# Altium schematic sheet DriverPNP_Sch.SchDoc: DriverPNP
size 127 x 101 mm; Author: Hom; CompanyName: KitSprout; DrawnBy: Hom; Engineer: Hom; Organization: KitSprout; Revision: A; SheetNumber: 1; SheetTotal: 1; Version: 1.0; LibVersion: 1.1
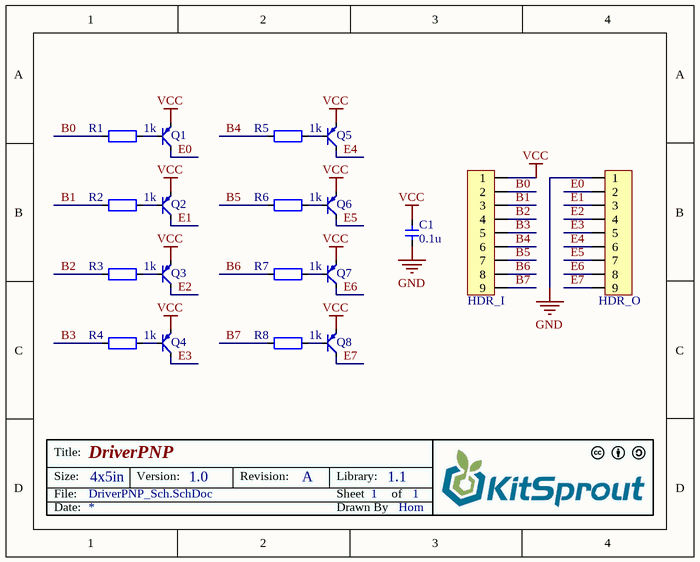
[diagram p0: DriverPNP_Sch.SchDoc]

## Parts
C1  value 0.1u  [CAP_0603]  (hidden comment: Cap_0603)
HDR_I  HDR1x9.54  [HDR1X9_2.54_180]  (value not drawn)
HDR_O  HDR1x9.54  [HDR1X9_2.54_180]  (value not drawn)
Q1  BJT_PNP  [SOT23-3]  (value not drawn)
Q2  BJT_PNP  [SOT23-3]  (value not drawn)
Q3  BJT_PNP  [SOT23-3]  (value not drawn)
Q4  BJT_PNP  [SOT23-3]  (value not drawn)
Q5  BJT_PNP  [SOT23-3]  (value not drawn)
Q6  BJT_PNP  [SOT23-3]  (value not drawn)
Q7  BJT_PNP  [SOT23-3]  (value not drawn)
Q8  BJT_PNP  [SOT23-3]  (value not drawn)
R1  value 1k  [RES_0603]  (hidden comment: Res_0603)
R2  value 1k  [RES_0603]  (hidden comment: Res_0603)
R3  value 1k  [RES_0603]  (hidden comment: Res_0603)
R4  value 1k  [RES_0603]  (hidden comment: Res_0603)
R5  value 1k  [RES_0603]  (hidden comment: Res_0603)
R6  value 1k  [RES_0603]  (hidden comment: Res_0603)
R7  value 1k  [RES_0603]  (hidden comment: Res_0603)
R8  value 1k  [RES_0603]  (hidden comment: Res_0603)

## Nets
GND: C1.1 HDR_O.1
VCC: C1.2 HDR_I.1 Q1.2(E) Q2.2(E) Q3.2(E) Q4.2(E) Q5.2(E) Q6.2(E) Q7.2(E) Q8.2(E)
B0: HDR_I.2 R1.1
B1: HDR_I.3 R2.1
B2: HDR_I.4 R3.1
B3: HDR_I.5 R4.1
B4: HDR_I.6 R5.1
B5: HDR_I.7 R6.1
B6: HDR_I.8 R7.1
B7: HDR_I.9 R8.1
E0: HDR_O.2 Q1.3(C)
E1: HDR_O.3 Q2.3(C)
E2: HDR_O.4 Q3.3(C)
E3: HDR_O.5 Q4.3(C)
E4: HDR_O.6 Q5.3(C)
E5: HDR_O.7 Q6.3(C)
E6: HDR_O.8 Q7.3(C)
E7: HDR_O.9 Q8.3(C)
NetQ1_1: Q1.1(B) R1.2
NetQ2_1: Q2.1(B) R2.2
NetQ3_1: Q3.1(B) R3.2
NetQ4_1: Q4.1(B) R4.2
NetQ5_1: Q5.1(B) R5.2
NetQ6_1: Q6.1(B) R6.2
NetQ7_1: Q7.1(B) R7.2
NetQ8_1: Q8.1(B) R8.2

## Notes on the sheet
- Title:
- Size:
- Date:
- File:
- 4x5in
- Version:
- Revision:
- Sheet
- Drawn By
- Library:
- of

## Library data of the parts
C1 = Cap_0603: Capacitor
HDR_I = HDR1x9_2.54_T: Header
HDR_O = HDR1x9_2.54: Header
Q1-Q8 = BJT_PNP: Transistor
R1-R8 = Res_0603: Resistor